# Altium project CurrentTransformerPrecisionRectifier.PrjPcb
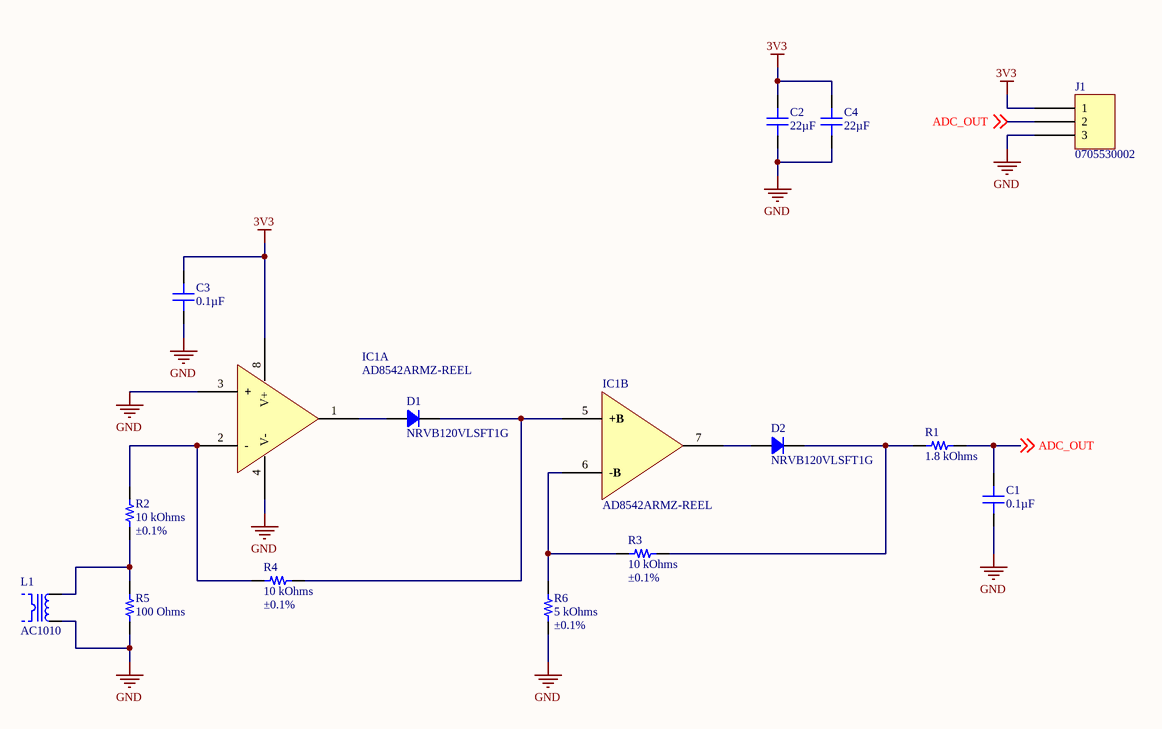
[diagram p0: 10ACurrentSensor.SchDoc]
1 sheet, 15 parts. Net scope: global (net labels, ports and power ports of the same name join across sheets).
Board file: Precision Rectifier CT.PcbDoc

## Sheet 10ACurrentSensor.SchDoc
size A4

### Parts
C1  0.1µF  [CAP 0603_1608]
C2  22µF  [CAP 1206_3216 - 1.0MM]
C3  0.1µF  [CAP 0603_1608]
C4  22µF  [CAP 1206_3216 - 1.0MM]
D1  NRVB120VLSFT1G  [SOD123F]
D2  NRVB120VLSFT1G  [SOD123F]
IC1  AD8542ARMZ-REEL  [ANALOG MSOP-8 RM-8]  (parts A,B of 2)
J1  0705530002  [MOLEX SDA-70553-3PIN]
L1  AC1010  [TALEMA AC1010]
R1  1.8 kOhms  [RES 0603_1608]
R2  Tolerance: ±0.1%  [RES 0603_1608]  (hidden comment: 10 kOhms)
R3  Tolerance: ±0.1%  [RES 0603_1608]  (hidden comment: 10 kOhms)
R4  Tolerance: ±0.1%  [RES 0603_1608]  (hidden comment: 10 kOhms)
R5  100 Ohms  [RES 0603_1608]
R6  Tolerance: ±0.1%  [RES 0603_1608]  (hidden comment: 5 kOhms)

### Nets
3V3: C2.2 C3.2 C4.2 IC1.8(V+) J1.1
GND: C1.1 C2.1 C3.1 C4.1 IC1.3(+) IC1.4(V-) J1.3 L1.1 R5.1 R6.2
ADC_OUT: C1.2 J1.2 R1.2 ; off-sheet ADC_OUT
NetD1_1: D1.1 IC1.1(OUT)
NetD1_2: D1.2 IC1.5(+B) R4.1
NetD2_1: D2.1 IC1.7(OUT_B)
NetD2_2: D2.2 R1.1 R3.1
NetIC1_2: IC1.2(-) R2.2 R4.2
NetIC1_6: IC1.6(-B) R3.2 R6.1
NetL1_2: L1.2 R2.1 R5.2

### Notes on the sheet
- Title
- Size:
- Date:
- A4
- Number:
- Time:
- Revision:
- Sheet
- of
- File:

### Library data of the parts
C1 C3 = CS0603KRX7R7BB104: CAP CER 0.1UF 16V X7R 0603; Manufacturer: Yageo; Tolerance: ±10%; Part Number: CS0603KRX7R7BB104; Value: 0.1µF; Applications: Boardflex Sensitive; Capacitance: 0.1µF; ComponentLink1Description: Datasheet; ComponentLink1URL: http://www.yageo.com/NewPortal/yageodocoutput?fileName=/pdf/MLCC/UPY-ST_NPOX7R_16V-to-3KV_5.pdf; ComponentLink2Description: DigiKey Link; ComponentLink2URL: http://digikey.com/product-detail/en/yageo/CS0603KRX7R7BB104/311-3560-1-ND/7648487; Device Package: 0603 (1608 Metric); Features: Soft Termination; LastUpdated: 02/01/2020 00:02:08; Lifecycle Status: Active; Minimum Order: 1; Mounting Type: Surface Mount, MLCC; Operating Temperature: -55°C ~ 125°C; Package / Case: 0603 (1608 Metric); Packaging: ReReel; PartId: 2286; Part Status: Active; Price: 0.00; Series: CS; Size / Dimension: 0.063" L x 0.031" W (1.60mm x 0.80mm); Supplier 1: DigiKey; Supplier Part Number 1: 311-3560-1-ND; Temperature Coefficient: X7R; Thickness (Max): 0.037" (0.95mm); Voltage - Rated: 16V
C2 C4 = CL31A226MOCLNNC: CAP CER 22UF 16V X5R 1206; Manufacturer: Samsung Electro-Mechanics; Tolerance: ±20%; Part Number: CL31A226MOCLNNC; Value: 22µF; Applications: General Purpose; Capacitance: 22µF; ComponentLink1Description: Datasheet; ComponentLink1URL: http://www.samsungsem.com/kr/support/product-search/mlcc/CL31A226MOCLNNC.jsp; ComponentLink2Description: DigiKey Link; ComponentLink2URL: http://digikey.com/product-detail/en/samsung-electro-mechanics/CL31A226MOCLNNC/1276-2728-1-ND/3890814; Device Package: 1206 (3216 Metric); Features: Low Profile; LastUpdated: 13/01/2020 00:03:54; Lifecycle Status: Active; Minimum Order: 1; Mounting Type: Surface Mount, MLCC; Operating Temperature: -55°C ~ 85°C; Package / Case: 1206 (3216 Metric); Packaging: TapeAndReel; PartId: 19106; Part Status: Active; Price: 0.08; Series: CL; Size / Dimension: 0.126" L x 0.063" W (3.20mm x 1.60mm); Supplier 1: DigiKey; Supplier Part Number 1: 1276-2728-1-ND; Temperature Coefficient: X5R; Thickness (Max): 0.037" (0.95mm); Voltage - Rated: 16V
D1 D2 = NRVB120VLSFT1G: DIODE SCHOTTKY 20V 1A SOD123; Manufacturer: ON Semiconductor; Current - Reverse Leakage @ Vr: 15mA @ 20V; Speed: Fast Recovery =< 500ns, > 200mA (Io); Voltage - Forward (Vf) (Max) @ If: 300mV @ 1A; Part Number: NRVB120VLSFT1G; ComponentLink1Description: Datasheet; ComponentLink1URL: http://www.onsemi.com/pub/Collateral/MBR120VLSFT1-D.PDF; ComponentLink2Description: DigiKey Link; ComponentLink2URL: http://digikey.com/product-detail/en/on-semiconductor/NRVB120VLSFT1G/NRVB120VLSFT1GOSCT-ND/8538727; Current - Average Rectified (Io): 1A; Device Package: SOD-123F; Diode Type: Schottky; LastUpdated: 02/01/2020 00:13:05; Lifecycle Status: Active; Minimum Order: 1; Mounting Type: Surface Mount; Operating Temperature - Junction: -65°C ~ 125°C; Package / Case: SOD-123F; Packaging: ReReel; PartId: 2453; Part Status: Active; Price: 0.00; Series: Automotive, AEC-Q101; Supplier 1: DigiKey; Supplier Part Number 1: NRVB120VLSFT1GOSCT-ND; Supplier Device Package: SOD-123FL; Voltage - DC Reverse (Vr) (Max): 20V
IC1 = AD8542ARMZ-REEL: IC OPAMP GP 2 CIRCUIT 8MSOP; Manufacturer: Analog Devices Inc.; Amplifier Type: General Purpose; Current - Input Bias: 4pA; Current - Output / Channel: 30mA; Current - Supply: 45µA; Gain Bandwidth Product: 1MHz; Number of Circuits: 2; Output Type: Rail-to-Rail; Slew Rate: 0.92V/µs; Voltage - Input Offset: 1mV; Voltage - Supply, Single/Dual (±): 2.7V ~ 5.5V; Part Number: AD8542ARMZ-REEL; ComponentLink1Description: Datasheet; ComponentLink1URL: https://www.analog.com/media/en/technical-documentation/data-sheets/AD8541_8542_8544.pdf; ComponentLink2Description: DigiKey Link; ComponentLink2URL: http://digikey.com/product-detail/en/analog-devices-inc/AD8542ARMZ-REEL/AD8542ARMZ-REELCT-ND/1957825; Device Package: 8-TSSOP, 8-MSOP (0.118", 3.00mm Width); LastUpdated: 08/01/2020 23:28:44; Lifecycle Status: Active; Minimum Order: 1; Mounting Type: Surface Mount; Operating Temperature: -40°C ~ 125°C; Package / Case: 8-TSSOP, 8-MSOP (0.118", 3.00mm Width); Packaging: ReReel; PartId: 7; Part Status: Active; Price: 0.00; Series: -; Supplier 1: DigiKey; Supplier Part Number 1: AD8542ARMZ-REELCT-ND; Supplier Device Package: 8-MSOP
J1 = 0705530002: CONN HEADER R/A 3POS 2.54MM; Manufacturer: Molex; Contact Length - Mating: 0.240" (6.10mm); Contact Length - Post: 0.130" (3.30mm); Material Flammability Rating: UL94 V-0; Number of Positions: 3; Number of Positions Loaded: All; Pitch - Mating: 0.100" (2.54mm); Shrouding: Shrouded - 4 Wall; Style: Board to Cable/Wire; Voltage Rating: 250V; ComponentLink1Description: Datasheet; ComponentLink1URL: https://www.molex.com/pdm_docs/sd/705530002_sd.pdf; ComponentLink2Description: DigiKey Link; ComponentLink2URL: http://digikey.com/product-detail/en/molex/0705530002/WM4901-ND/114955; Connector Type: Header; Contact Finish - Mating: Gold; Contact Finish - Post: Tin; Contact Finish Thickness - Mating: 15.0µin (0.38µm); Contact Material: Phosphor Bronze; Contact Shape: Square; Contact Type: Male Pin; Fastening Type: Latch Holder; Insulation Color: Black; Insulation Height: 0.215" (5.45mm); Insulation Material: Polyester, Glass Filled; LastUpdated: 12/01/2020 23:55:56; Lifecycle Status: Active; Part Number: 0705530002; Minimum Order: 1; Mounting Type: Through Hole, Right Angle; Number of Rows: 1; Operating Temperature: -40°C ~ 105°C; Packaging: Tube; PartId: 86; Part Status: Active; Price: 1.02; Series: SL 70553; Supplier 1: DigiKey; Supplier Part Number 1: WM4901-ND; Termination: Solder
L1 = AC1010: CURR SENSE XFMR 10A T/H; Manufacturer: Talema Group LLC; Current Ratio: 1000:1; DC Resistance (DCR): 41.8Ohm; Frequency Range: 50/60Hz; Type: Non-Invasive (Solid Core); Part Number: AC1010; ComponentLink1Description: Datasheet; ComponentLink1URL: http://www.talema.com/uploads/documents/product-datasheets/AC%20Series.pdf; ComponentLink2Description: DigiKey Link; ComponentLink2URL: http://digikey.com/product-detail/en/talema-group-llc/AC1010/1295-1102-ND/3881333; Current Rating (Amps): 10A; Height - Seated (Max): 0.937" (23.80mm); LastUpdated: 07/01/2020 18:42:16; Lifecycle Status: Active; Minimum Order: 1; Mounting Type: Through Hole; Packaging: Tube; Part Status: Active; Price: 5.81; Series: AC; Size / Dimension: 0.937" L x 0.438" W (23.80mm x 11.12mm); Supplier 1: DigiKey; Supplier Part Number 1: 1295-1102-ND; Termination Style: PC Pin
R1 = RMCF0603JT1K80: RES 1.8K OHM 5% 1/10W 0603; Manufacturer: Stackpole Electronics Inc; Power (Watts): 0.1W, 1/10W; Temperature Coefficient: ±200ppm/°C; Part Number: RMCF0603JT1K80; Value: 1.8 kOhms; ComponentLink1Description: Datasheet; ComponentLink1URL: https://www.seielect.com/catalog/sei-rmcf_rmcp.pdf; ComponentLink2Description: DigiKey Link; ComponentLink2URL: http://digikey.com/product-detail/en/stackpole-electronics-inc/RMCF0603JT1K80/RMCF0603JT1K80CT-ND/1943176; Composition: Thick Film; Device Package: 0603 (1608 Metric); Features: Automotive AEC-Q200; Height - Seated (Max): 0.022" (0.55mm); LastUpdated: 02/01/2020 00:07:01; Lifecycle Status: Active; Minimum Order: 1; Number of Terminations: 2; Operating Temperature: -55°C ~ 155°C; Package / Case: 0603 (1608 Metric); Packaging: TapeAndReel; PartId: 5907; Part Status: Active; Price: 0.00; Ratings: AEC-Q200; Resistance: 1.8 kOhms; Series: RMCF; Size / Dimension: 0.061" L x 0.031" W (1.55mm x 0.80mm); Supplier 1: DigiKey; Supplier Part Number 1: RMCF0603JT1K80CT-ND; Supplier Device Package: 0603; Tolerance: ±5%
R2-R4 = ERA-3AEB103V: RES SMD 10K OHM 0.1% 1/10W 0603; Manufacturer: Panasonic Electronic Components; Power (Watts): 0.1W, 1/10W; Temperature Coefficient: ±25ppm/°C; Part Number: ERA-3AEB103V; Value: 10 kOhms; ComponentLink1Description: Datasheet; ComponentLink1URL: https://industrial.panasonic.com/cdbs/www-data/pdf/RDM0000/AOA0000C307.pdf; ComponentLink2Description: DigiKey Link; ComponentLink2URL: http://digikey.com/product-detail/en/panasonic-electronic-components/ERA-3AEB103V/P10KDBCT-ND/1466076; Composition: Thin Film; Device Package: 0603 (1608 Metric); Features: Automotive AEC-Q200; Height - Seated (Max): 0.022" (0.55mm); LastUpdated: 02/01/2020 00:07:02; Lifecycle Status: Active; Minimum Order: 1; Number of Terminations: 2; Operating Temperature: -55°C ~ 155°C; Package / Case: 0603 (1608 Metric); Packaging: ReReel; PartId: 5506; Part Status: Active; Price: 0.00; Ratings: AEC-Q200; Resistance: 10 kOhms; Series: ERA-3A; Size / Dimension: 0.063" L x 0.031" W (1.60mm x 0.80mm); Supplier 1: DigiKey; Supplier Part Number 1: P10KDBCT-ND; Supplier Device Package: 0603
R5 = ESR03EZPJ101: RES SMD 100 OHM 5% 1/4W 0603; Manufacturer: Rohm Semiconductor; Power (Watts): 0.25W, 1/4W; Temperature Coefficient: ±200ppm/°C; Part Number: ESR03EZPJ101; Value: 100 Ohms; ComponentLink1Description: Datasheet; ComponentLink1URL: https://www.rohm.com/datasheet/ESR01MZPF/esr-e; ComponentLink2Description: DigiKey Link; ComponentLink2URL: http://digikey.com/product-detail/en/rohm-semiconductor/ESR03EZPJ101/RHM100DCT-ND/1983776; Composition: Thick Film; Device Package: 0603 (1608 Metric); Features: Automotive AEC-Q200, Pulse Withstanding; Height - Seated (Max): 0.022" (0.55mm); LastUpdated: 02/01/2020 00:07:02; Lifecycle Status: Active; Minimum Order: 1; Number of Terminations: 2; Operating Temperature: -55°C ~ 155°C; Package / Case: 0603 (1608 Metric); Packaging: ReReel; PartId: 5450; Part Status: Active; Price: 0.00; Ratings: AEC-Q200; Resistance: 100 Ohms; Series: ESR; Size / Dimension: 0.063" L x 0.031" W (1.60mm x 0.80mm); Supplier 1: DigiKey; Supplier Part Number 1: RHM100DCT-ND; Supplier Device Package: 0603; Tolerance: ±5%
R6 = PNM0603E5001BST5: RES SMD 5K OHM 0.1% 0.15W 0603; Manufacturer: Vishay Thin Film; Temperature Coefficient: ±25ppm/°C; Part Number: PNM0603E5001BST5; Value: 5 kOhms; ComponentLink1Description: Datasheet; ComponentLink1URL: http://www.vishay.com/docs/60057/pnm.pdf; ComponentLink2Description: DigiKey Link; ComponentLink2URL: http://digikey.com/product-detail/en/vishay-thin-film/PNM0603E5001BST5/PNM0603-5.0KBCT-ND/2120383; Composition: Thin Film; Device Package: 0603 (1608 Metric); Features: Anti-Sulfur, Moisture Resistant, Non-Inductive, Non-Magnetic; Height - Seated (Max): 0.020" (0.51mm); LastUpdated: 02/01/2020 00:06:54; Lifecycle Status: Active; Minimum Order: 1; Number of Terminations: 2; Operating Temperature: -55°C ~ 155°C; Package / Case: 0603 (1608 Metric); Packaging: ReReel; PartId: 11960; Part Status: Active; Power (Watts): 0.15W; Price: 0.00; Resistance: 5 kOhms; Series: PNM; Size / Dimension: 0.064" L x 0.032" W (1.63mm x 0.81mm); Supplier 1: DigiKey; Supplier Part Number 1: PNM0603-5.0KBCT-ND; Supplier Device Package: 0603